# EAGLE design led_driver_12v_1a (EAGLE 7.5.0)
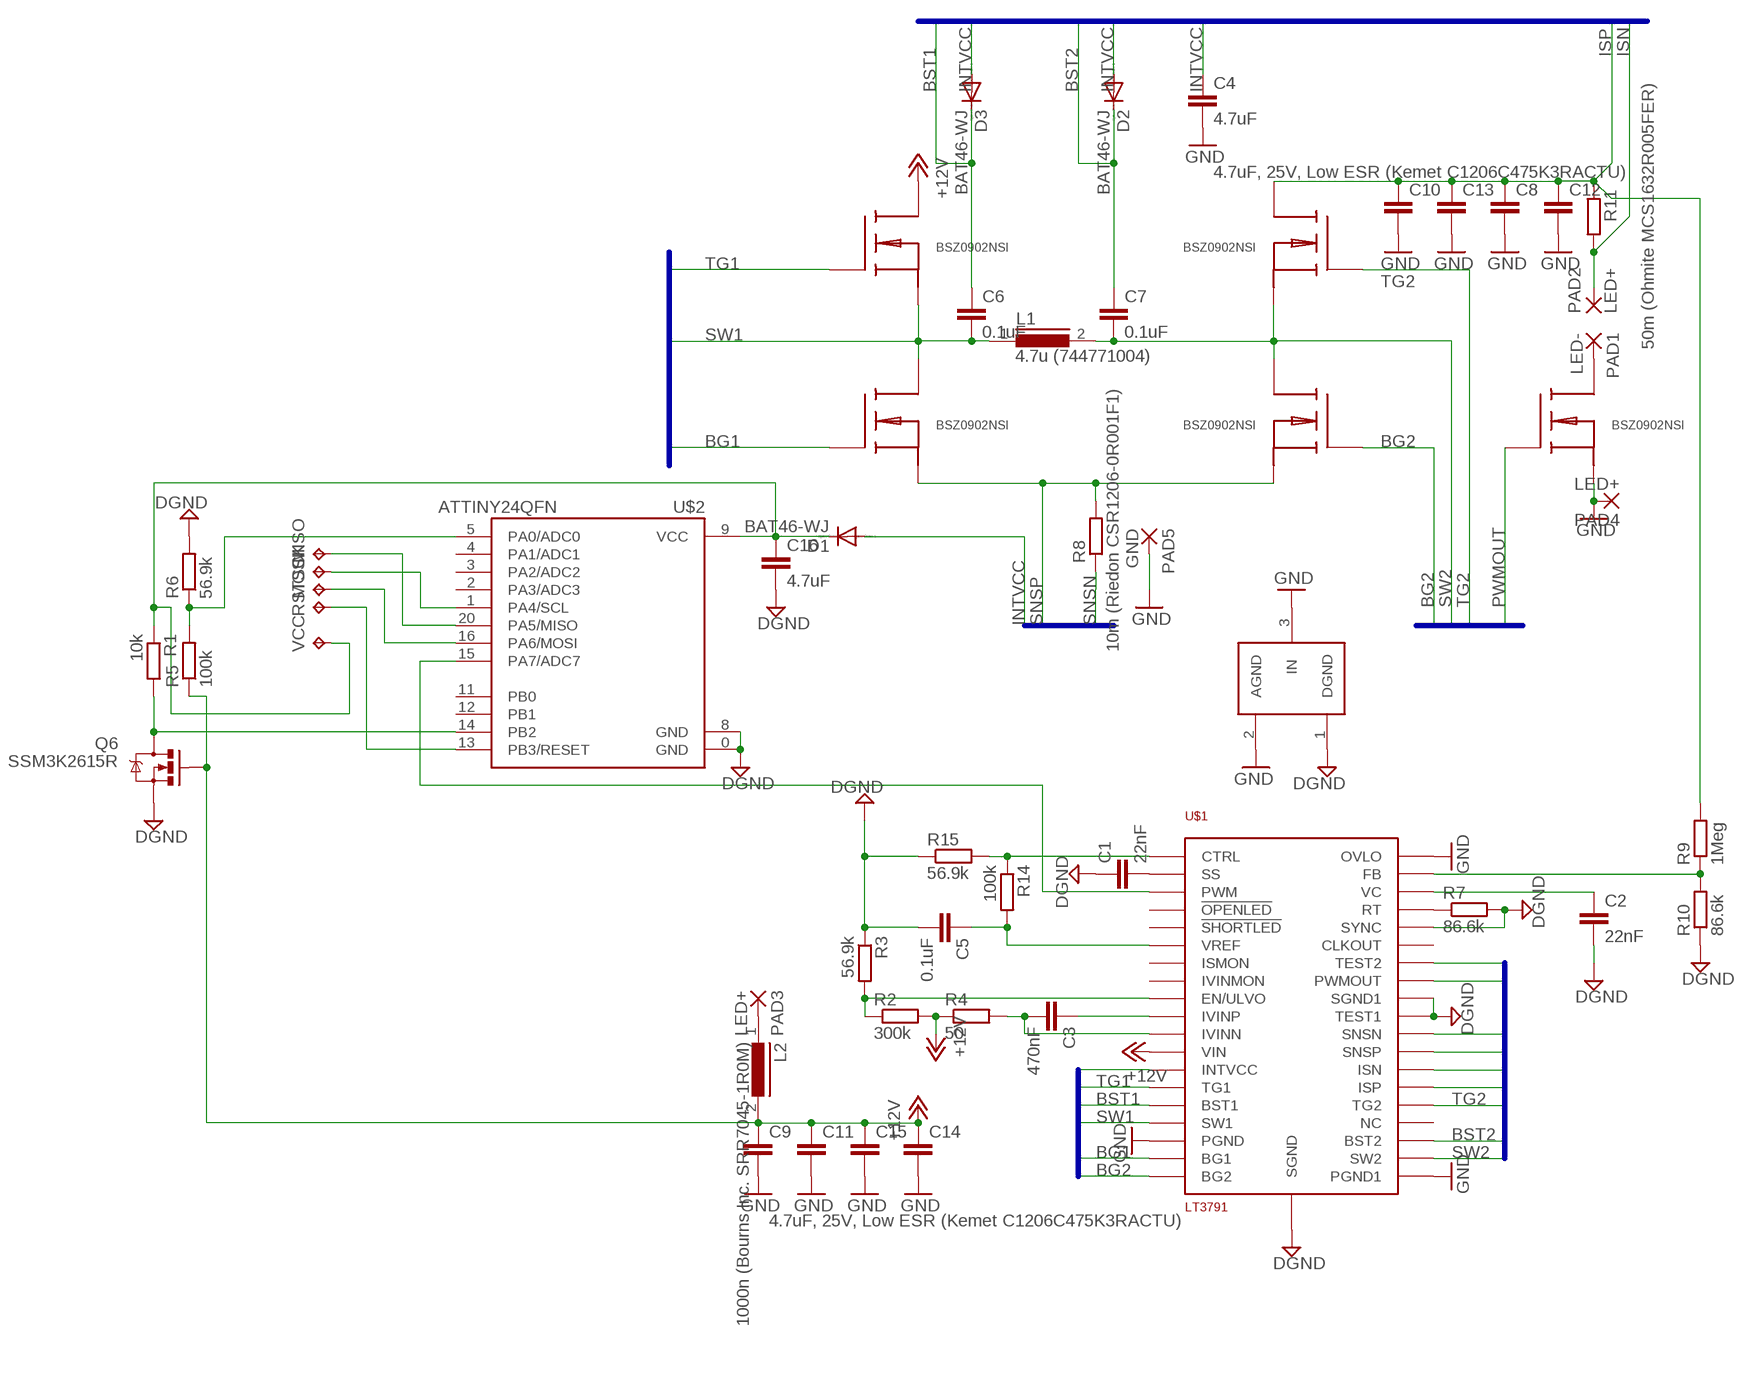
[diagram p0: schematic, sheet 1]

## Parts
C1  22nF  C-EUC0402K  [C0402K]
C2  22nF  C-EUC0402K  [C0402K]
C3  470nF  C-EUC0402K  [C0402K]
C4  4.7uF  C-EUC1206  [C1206]
C5  0.1uF  C-EUC0402K  [C0402K]
C6  0.1uF  C-EUC0402K  [C0402K]
C7  0.1uF  C-EUC0402K  [C0402K]
C8  4.7uF, 25V, Low ESR (Kemet C1206C475K3RACTU)  C-EUC1206  [C1206]
C9  4.7uF, 25V, Low ESR (Kemet C1206C475K3RACTU)  C-EUC1206  [C1206]
C10  4.7uF, 25V, Low ESR (Kemet C1206C475K3RACTU)  C-EUC1206  [C1206]
C11  4.7uF, 25V, Low ESR (Kemet C1206C475K3RACTU)  C-EUC1206  [C1206]
C12  4.7uF, 25V, Low ESR (Kemet C1206C475K3RACTU)  C-EUC1206  [C1206]
C13  4.7uF, 25V, Low ESR (Kemet C1206C475K3RACTU)  C-EUC1206  [C1206]
C14  4.7uF, 25V, Low ESR (Kemet C1206C475K3RACTU)  C-EUC1206  [C1206]
C15  4.7uF, 25V, Low ESR (Kemet C1206C475K3RACTU)  C-EUC1206  [C1206]
C16  4.7uF  C-EUC1206  [C1206]
D1  BAT46-WJ  DIODE-SOD323-W  [SOD323-W]
D2  BAT46-WJ  DIODE-SOD323-W  [SOD323-W]
D3  BAT46-WJ  DIODE-SOD323-W  [SOD323-W]
L1  4.7u (744771004)  DR127  [DR127]
L2  1000n (Bourns Inc. SRR7045-1R0M)  DR74  [DR74]
MISO  TPTP11R  [TP11R]
MOSI  TPTP11R  [TP11R]
PAD1  LED-  WIREPADSMD5-2,5  [5-2,5]
PAD2  LED+  WIREPADSMD5-2,5  [5-2,5]
PAD3  LED+  WIREPADSMD5-2,5  [5-2,5]
PAD4  LED+  WIREPADSMD5-2,5  [5-2,5]
PAD5  GND  WIREPADSMD1,27-254  [SMD1,27-2,54]
Q1  BSZ0902NSI  BSZ090X  [BSZ090X]
Q2  BSZ0902NSI  BSZ090X  [BSZ090X]
Q3  BSZ0902NSI  BSZ090X  [BSZ090X]
Q4  BSZ0902NSI  BSZ090X  [BSZ090X]
Q5  BSZ0902NSI  BSZ090X  [BSZ090X]
Q6  SSM3K2615R  MOSFET-NCHANNELBSS123LT1G  [SOT23-3]
R1  10k  R-EU_R0402  [R0402]
R2  300k  R-EU_R0402  [R0402]
R3  56.9k  R-EU_R0402  [R0402]
R4  50  R-EU_R0402  [R0402]
R5  100k  R-EU_R0402  [R0402]
R6  56.9k  R-EU_R0402  [R0402]
R7  86.6k  R-EU_R0402  [R0402]
R8  10m (Riedon CSR1206-0R001F1)  R-EU_R1206  [R1206]
R9  1Meg  R-EU_R0402  [R0402]
R10  86.6k  R-EU_R0402  [R0402]
R11  50m (Ohmite MCS1632R005FER)  R-EU_R1206  [R1206]
R14  100k  R-EU_R0402  [R0402]
R15  56.9k  R-EU_R0402  [R0402]
RST  TPTP11R  [TP11R]
SCK  TPTP11R  [TP11R]
U$1  LT3791  [TSSOP38]
U$2  ATTINY24QFN  [QFN20]
U$4  GND_CONNECT  [GND_CONNECT]
VCC  TPTP11R  [TP11R]

## Nets
+12V: C9.1 C11.1 C14.1 C15.1 L2.2 Q1.D Q1.D@1(D) Q1.D@2(D) Q1.D@3(D) Q1.D@4(D) Q6.1(G) R2.2 R4.1 R5.1 U$1.P$12(VIN)
BG1 [HI_PWR]: Q2.G U$1.P$18(BG1)
BG2 [HI_PWR]: Q3.G U$1.P$19(BG2)
BST1 [HI_PWR]: C6.1 D3.C U$1.P$15(BST1)
BST2 [HI_PWR]: C7.1 D2.C U$1.P$22(BST2)
DGND: C1.1 C2.2 C5.2 C16.2 Q6.2(S) R3.1 R6.2 R7.2 R10.1 R15.1 U$1.P$29(TEST1) U$1.P$30(SGND) U$1.P$34(SYNC) U$1.P$39(SGND1) U$2.0(GND) U$2.8(GND) U$4.1(DGND)
GND [HI_PWR]: C4.2 C8.2 C9.2 C10.2 C11.2 C12.2 C13.2 C14.2 C15.2 PAD4.1(P) PAD5.1(P) Q5.S@1(S) Q5.S@2(S) Q5.S@3(S) Q5.S@4(S) U$1.P$17(PGND) U$1.P$20(PGND1) U$1.P$38(OVLO) U$4.2(AGND) U$4.3(IN)
INTVCC [HI_PWR]: C4.1 D1.A D2.A D3.A U$1.P$13(INTVCC) U$1.P$32(TEST2)
ISN: PAD2.1(P) R11.2 U$1.P$26(ISN)
ISP: C8.1 C10.1 C12.1 C13.1 Q4.D Q4.D@1(D) Q4.D@2(D) Q4.D@3(D) Q4.D@4(D) R9.2 R11.1 U$1.P$25(ISP)
N$1: C5.1 R14.2 U$1.P$6(VREF)
N$2: R14.1 R15.2 U$1.P$1(CTRL)
N$3: R7.1 U$1.P$35(RT)
N$4: C1.2 U$1.P$2(SS)
N$5: C2.1 U$1.P$36(VC)
N$6: R9.1 R10.2 U$1.P$37(FB)
N$7: C3.1 U$1.P$10(IVINP)
N$9: C3.2 R4.2 U$1.P$11(IVINN)
N$11: R2.1 R3.2 U$1.P$9(EN/ULVO)
N$12: C16.1 D1.C R1.1 U$2.9(VCC) VCC.TP
N$13: Q6.3(D) R1.2 U$2.14(PB2)
N$14: U$1.P$3(PWM) U$2.15(PA7/ADC7)
N$15: R5.2 R6.1 U$2.5(PA0/ADC0)
N$16: MISO.TP U$2.20(PA5/MISO)
N$17: MOSI.TP U$2.16(PA6/MOSI)
N$18: RST.TP U$2.13(PB3/RESET)
N$19: PAD1.1(P) Q5.D Q5.D@1(D) Q5.D@2(D) Q5.D@3(D) Q5.D@4(D)
N$20: SCK.TP U$2.1(PA4/SCL)
N$21: L2.1 PAD3.1(P)
PWMOUT [HI_PWR]: Q5.G U$1.P$31(PWMOUT)
SNSN [HI_PWR]: R8.1 U$1.P$28(SNSN)
SNSP [HI_PWR]: Q2.S@1(S) Q2.S@2(S) Q2.S@3(S) Q2.S@4(S) Q3.S@1(S) Q3.S@2(S) Q3.S@3(S) Q3.S@4(S) R8.2 U$1.P$27(SNSP)
SW1 [HI_PWR]: C6.2 L1.1 Q1.S@1(S) Q1.S@2(S) Q1.S@3(S) Q1.S@4(S) Q2.D Q2.D@1(D) Q2.D@2(D) Q2.D@3(D) Q2.D@4(D) U$1.P$16(SW1)
SW2 [HI_PWR]: C7.2 L1.2 Q3.D Q3.D@1(D) Q3.D@2(D) Q3.D@3(D) Q3.D@4(D) Q4.S@1(S) Q4.S@2(S) Q4.S@3(S) Q4.S@4(S) U$1.P$21(SW2)
TG1 [HI_PWR]: Q1.G U$1.P$14(TG1)
TG2 [HI_PWR]: Q4.G U$1.P$24(TG2)
Unconnected: U$1.P$4(!OPENLED) U$1.P$5(!SHORTLED) U$1.P$7(ISMON) U$1.P$8(IVINMON) U$1.P$23(NC) U$1.P$33(CLKOUT) U$2.2(PA3/ADC3) U$2.3(PA2/ADC2) U$2.4(PA1/ADC1) U$2.11(PB0) U$2.12(PB1)

## Buses
BG1,BG2,SW1,SW2,TG1,TG2,BST1,BST2,INTVCC
BG1,BG2,SW1,SW2,TG1,TG2,BST1,BST2,INTVCC,PWMOUT,SNSP,SNSN,ISN,ISP

## Library data of the parts
C1-C3 C5-C7 = resistor:C-EU: CAPACITOR, European symbol
C4 C8-C16 = rcl:C-EU: CAPACITOR, European symbol
D1-D3 = diode:DIODE-: DIODE
L1 = inductors:DR127: High Power Density, High Efficiency, Shielded Inductors Source: coiltronics_dr_series.pdf
L2 = inductors:DR74: High Power Density, High Efficiency, Shielded Inductors Source: coiltronics_dr_series.pdf
MISO MOSI RST SCK VCC = testpad:TP: Test pad
PAD1-PAD5 = wirepad:WIREPAD: Wire PAD connect wire on PCB
Q1-Q5 = vsd_custom:BSZ090X
Q6 = SparkFun-DiscreteSemi:MOSFET-NCHANNEL: Common NMOSFET Parts MFG P/N Store ID Prod ID FDD8780 TRANS-09984 SI7820DN TRANS-11055 FDS6630A IC-08089 2N7002PW TRANS-11151 FQP30N06L COM-10213 TRANS-10060 BSS123LT1G TRANS-08345 BSS138 TRANS-00830 BS170 2N7000; PROD_ID: TRANS-08345
R1-R11 R14 R15 = resistor:R-EU_: RESISTOR, European symbol
U$1 = ltc3791:LT3791
U$2 = SparkFun-DigitalIC:ATTINY24: Atmel 20-pin 2kB flash uC
U$4 = SparkFun-Passives:GND_CONNECT: Use to make a connection of multiple grounds in only one place.

## Net classes
0 default: width 0.152 mm, clearance 0.152 mm
1 HI_PWR: width 0.3 mm, drill 0.4 mm, clearance 0.15 mm

## Board
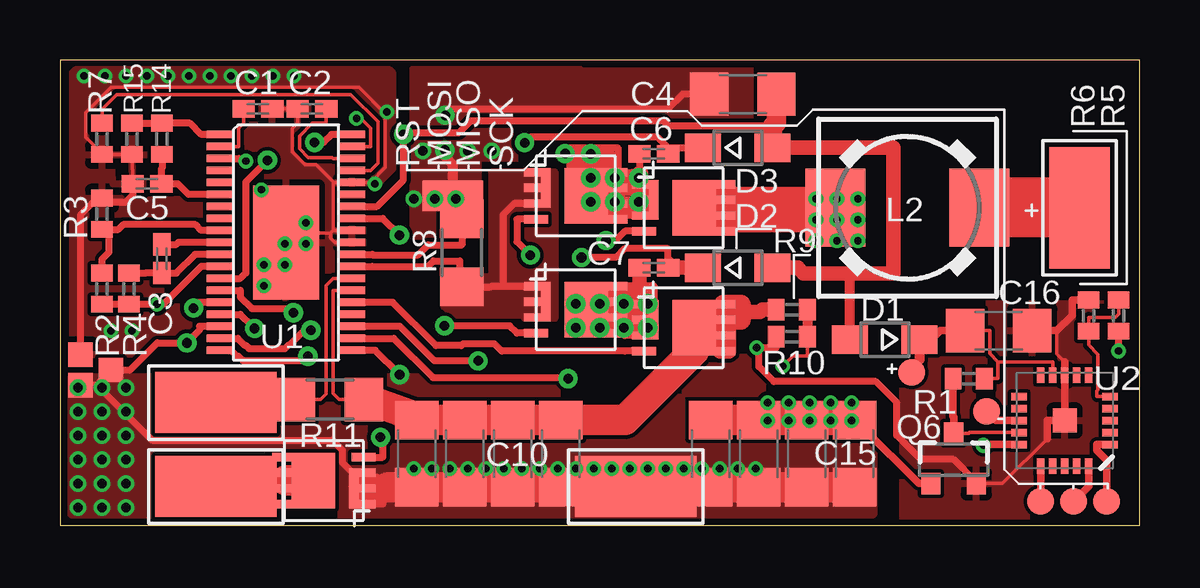
[diagram p1: board, top side]
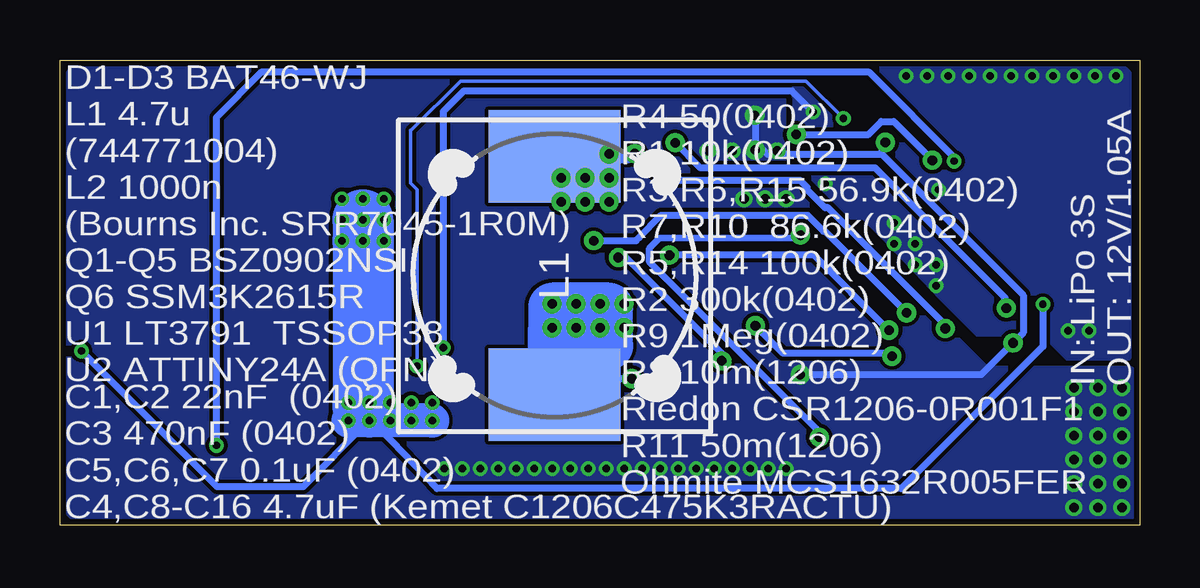
[diagram p2: board, bottom side, seen from below]

Size 45.02 x 19.41 mm. Coordinates in mm from the lower left corner, seen from the top.
Outline: 0,0 45.02,0 45.02,19.41 0,19.41 0,0
Copper layers (1*16): Top 0.035mm / dielectric 1.5mm / Bottom 0.035mm
Design rules "SeeedStudio_2layer_DRU_no_angle_20140221": minimum track width 6mil, minimum drill 12mil, track to track 6mil, track to pad 6mil, pad to pad 6mil, via to via 6mil, smd to smd 0mil, copper to edge 10mil, drill to drill 10mil, minimum pad ring 10mil, minimum via ring 6mil, stop-mask expansion 2mil, vias tented up to drill 100mil, thermal gap 10mil

### Footprints (pad centres in the part's own frame; a part is rotated, then mirrored left to right if it is on the bottom)
C0402K = smd 0.925 x 0.74: 1 -0.6,0; 2 0.6,0
C1206 = smd 1.6 x 1.8: 1 -1.4,0; 2 1.4,0
SOD323-W = smd 1.5 x 1.2: A 1.45,0; C -1.45,0
DR127 = smd 3.85 x 5.5: 1 -4.975,0; 2 4.975,0
DR74 = smd 2.5 x 3.25: 1 -3,0; 2 3,0
TP11R = smd 1.1 x 1.1: TP 0,0
5-2,5 = smd 2.54 x 5.08: 1 0,0
SMD1,27-2,54 = smd 1.27 x 2.54: 1 0,0
BSZ090X = smd 1.8 x 2.3: D 0.44,0 | smd 1 x 0.35: D@1 1.65,-0.975; D@2 1.65,-0.325; D@3 1.65,0.325; D@4 1.65,0.975; G -1.65,-0.975; S@2 -1.65,-0.325; S@3 -1.65,0.325; S@4 -1.65,0.975 | smd 0.4 x 1.65: S@1 -1.25,0.325
SOT23-3 = smd 0.8 x 0.9: 1 -0.95,-1; 2 0.95,-1; 3 0,1.1
R0402 = smd 0.7 x 0.9: 1 -0.65,0; 2 0.65,0
R1206 = smd 1.6 x 1.803: 1 -1.422,0; 2 1.422,0
TSSOP38 = smd 1.1 x 0.315: P$1 -2.75,4.5; P$2 -2.75,4; P$3 -2.75,3.5; P$4 -2.75,3; P$5 -2.75,2.5; P$6 -2.75,2; P$7 -2.75,1.5; P$8 -2.75,1; P$9 -2.75,0.5; P$10 -2.75,0; P$11 -2.75,-0.5; P$12 -2.75,-1; P$13 -2.75,-1.5; P$14 -2.75,-2; P$15 -2.75,-2.5; P$16 -2.75,-3; P$17 -2.75,-3.5; P$18 -2.75,-4; P$19 -2.75,-4.5; P$20 2.75,-4.5; P$21 2.75,-4; P$22 2.75,-3.5; P$23 2.75,-3; P$24 2.75,-2.5; P$25 2.75,-2; P$26 2.75,-1.5; P$27 2.75,-1; P$28 2.75,-0.5; P$29 2.75,0; P$30 2.75,0.5; P$31 2.75,1; P$32 2.75,1.5; P$33 2.75,2; P$34 2.75,2.5; P$35 2.75,3; P$36 2.75,3.5; P$37 2.75,4; P$38 2.75,4.5 | smd 2.75 x 4.75: P$39 0,0
QFN20 = smd 1 x 1: 0 0,0 | smd 0.65 x 0.3: 1 -1.9,1; 2 -1.9,0.5; 3 -1.9,0; 4 -1.9,-0.5; 5 -1.9,-1; 11 1.9,-1; 12 1.9,-0.5; 13 1.9,0; 14 1.9,0.5; 15 1.9,1 | smd 0.3 x 0.65: 6 -1,-1.9; 7 -0.5,-1.9; 8 0,-1.9; 9 0.5,-1.9; 10 1,-1.9; 16 1,1.9; 17 0.5,1.9; 18 0,1.9; 19 -0.5,1.9; 20 -1,1.9
GND_CONNECT = smd 1.016 x 1.016: 1 -1.016,0; 2 -1.016,-1.27; 3 0.254,-0.635

### Placement (x,y rotation side)
C1  8.25,17.38 180 top
C2  10.5,17.38 180 top
C3  4.25,11.12 270 top
C4  28.46,17.99 180 top
C5  3.62,14.25 180 top
C6  24.75,15.5 180 top
C7  24.75,10.75 180 top
C8  16.88,3 270 top
C9  27.12,3 270 top
C10  20.88,3 270 top
C11  29.12,3 270 top
C12  14.88,3 270 top
C13  18.88,3 270 top
C14  33.12,3 270 top
C15  31.12,3 270 top
C16  39.12,8.12 0 top
D1  34.38,7.75 180 top
D2  28.25,10.75 0 top
D3  28.25,15.75 0 top
L1  24.4,10.43 270 bottom
L2  35.33,13.25 180 top
MISO  42.25,1 90 top
MOSI  40.88,1 90 top
PAD1  6.5,1.62 270 top
PAD2  6.5,5.12 270 top
PAD3  42.5,13.25 0 top
PAD4  24,1.62 90 top
PAD5  16.38,13.75 270 top
Q1  26,13.25 0 top
Q2  21.5,13.75 0 top
Q3  21.5,9 0 top
Q4  26,8.25 0 top
Q5  11,1.88 180 top
Q6  37.25,2.75 0 top
R1  37.88,6.12 180 top
R2  1.75,9.88 270 top
R3  1.75,13 270 top
R4  2.88,9.88 90 top
R5  44.12,8.75 90 top
R6  42.88,8.75 90 top
R7  1.75,16.12 270 top
R8  16.75,11.38 270 top
R9  30.5,9 180 top
R10  30.5,7.88 0 top
R11  11.25,5.25 180 top
R14  4.25,16.12 270 top
R15  3,16.12 90 top
RST  38.62,4.75 90 top
SCK  43.62,1 90 top
U$1  9.42,11.8 0 top
U$2  41.88,4.38 180 top
U$4  1.88,7.12 0 top
VCC  35.5,6.38 90 top

### Tracks (layer width: path | path; a pad name or v marks a point on that pad's centre or on a via)
+12V  (via drill 0.3 pad 0.61)
  Top 0.152: L2.2 32.24,13.25 32.22,13.25 32.02,13.18 | 27.76,12.24 28.01,12.65 | 31.2,4.79 v33,4.38 31.84,4.77 31,4.68 31.12,4.91 | C14.1 33.25,4 33.42,4.12 | 31.12,4.66 31.74,4.66 32,4.4 | 31.12,4.66 31.12,4.91 | C15.1 31.12,4.66 | 31.12,4.91 30.77,4.91 30.25,4.4 | 28.01,12.65 26.51,13.18 Q1.D@2 27.57,13.01 27.94,13.25 | Q1.D@1 28.01,12.65 | Q1.D@4 28,14.22 28,13.57 Q1.D@3 27.94,13.49 27.94,13.25 | R4.1 3.21,9.22 | Q1.D 27.94,13.25
  Top 0.3: 3.21,9.22 v4.04,9.22 4.31,9.22 5.89,10.8 U$1.P$12 | v44.12,7.28 R5.1 | R4.1 R2.2 | 32.49,12.73 33.26,12.73 v33.26,12.75 | v33.26,11.88 v33.26,12.75 | v33.26,13.63 v33.26,12.75 | v32.39,13.63 32.33,13.63 L2.2 | 31.51,13.18 v31.51,12.75 | 32.02,13.18 31.51,13.18 | 31.51,13.18 v31.51,13.63 | v31.25,5.12 31.12,5.12 31.12,4.91 | C15.1 31.25,4.4 v31.25,4.38 | 30.25,4.4 30.38,4.4 v30.38,4.38 | C11.1 29.5,4.4 v30.38,5.12 | v29.5,5.12 v29.5,4.38
  Top 0.305: Q6.1 35.8,1.75 33.42,4.12
  Top 1.27: C14.1 32,4.4 | 30.25,4.4 C11.1 C9.1
  Top 1.676: 32.24,13.25 32.49,12.73 v32.39,12.75
  Top 1.9: 26.51,13.18 32.02,13.18
  Bottom 0.3: v4.04,9.22 4.04,7.46 9.95,1.55 29.3,1.55 32.12,4.5 | 32.12,4.5 v33,4.38 32.25,4.25 34.88,1.62 38.47,1.62 v44.12,7.28 | v31.51,12.75 v31.51,11.88 | v32.12,5.12 32.12,4.97 32.39,4.97 33,4.97 v33,5.12 | 32.12,4.5 v32.12,4.38
  Bottom 1.422: 32.39,4.97 v33,4.38 v32.12,4.38 v29.5,4.38
  Bottom 2.54: v32.39,12.75 v32.39,11.88 32.39,4.97
BG1  (via drill 0.4 pad 0.8)
  Top 0.3: v19.61,11.28 19.05,11.84 19.05,12.78 Q2.G | U$1.P$18 7.41,7.8 7.69,7.52 7.73,7.52 7.88,7.38 9.38,7.38 9.52,7.52 9.54,7.52 10.17,8.14 v10.46,8.14
  Bottom 0.3: v10.46,8.14 13.59,11.28 v19.61,11.28
BG2  (via drill 0.4 pad 0.8)
  Top 0.3: v16.02,8.33 18.75,8.33 19.05,8.03 Q3.G | v10.33,7.06 10.25,7 10.12,6.88 7.62,6.88 7.44,7.06 7.39,7.06 7.14,7.3 U$1.P$19
  Bottom 0.3: v10.33,7.06 10.38,7.12 10.43,7.18 14.88,7.18 v16.02,8.33
BST1  (via drill 0.4 pad 0.8)
  Top 0.3: U$1.P$15 5.81,9.3 v5.57,9.07 | v19.37,15.96 19.62,16.21 24.89,16.21 25.35,15.75 | 25.35,15.75 D3.C | 25.35,15.75 25.35,15.62 C6.1
  Bottom 0.3: v5.57,9.07 5.5,9.12 5.62,9.25 5.62,9.5 11.04,14.91 11.41,14.91 18.31,14.91 v19.37,15.96
BST2  (via drill 0.4 pad 0.8)
  Top 0.3: v17.43,6.87 15.61,6.87 14.17,8.3 U$1.P$22 | 25.35,11.09 25.41,11.09 25.75,10.75 | 25.35,11.09 25.35,11.54 23.54,11.54 23.17,11.18 v21.74,11.18 | C7.1 25.35,11.09
  Top 0.61: D2.C 25.75,10.75
  Bottom 0.3: v17.43,6.87 17.38,7.12 21.43,11.18 v21.74,11.18
DGND  (via drill 0.3, 0.3 pad 0.61)
  Top 0.152: 11.43,14.3 10.69,15.04 10.22,15.04 9.68,15.59 9.68,16.55 9.9,16.78 9.9,17.08 | 11.43,14.3 11.39,14.27 11.39,12.3 | C1.1 9.54,17.38 9.84,17.08 9.9,17.08 | C2.2 9.9,17.08 | 13.56,17.18 13.56,14.92 12.95,14.3 U$1.P$34 11.43,14.3 | v13.62,17.25 13.56,17.18 | 13.56,17.18 12.46,18.28 2.13,18.28 1.07,17.22 1.07,16.2 1.8,15.47 | R10.1 29.85,7.41 | 1.8,15.47 1.95,15.47 2.01,15.47 2.43,15.47 R15.1 3,14.87 3.02,14.85 C5.2 | R7.2 1.8,15.47 | 41.88,6.83 41.55,7.15 41.55,8.12 | U$2.0 41.74,4.38 | 11.39,12.3 11.28,12.19 | U$1.P$30 11.39,12.3 | 11.28,12.19 11.28,12 11.47,11.8 U$1.P$29 | 1.64,13.74 1.75,13.49 R3.1 | Q6.2 38.51,1.75 38.83,1.75 | 41.15,3.62 39.27,1.75 38.83,1.75 | 38.83,1.75 | 11.28,12.19 9.42,12.19 U$1.P$39
  Top 0.3: 29.85,7.41 v29.04,7.41 29.12,7.33 29.12,6.62 29.75,6 34,6 34.88,5.12 34.88,3.75 35.88,2.75 37.25,2.75 38.2,1.8 Q6.2 | U$4.1 0.86,12.96 1.64,13.74 | C5.2 3.02,13.78 2.73,13.49 1.75,13.49
  Top 0.305: R6.2 42.2,9.4 42.2,8.77 41.55,8.12 C16.2 | 41.88,6.83 U$2.8 U$2.0 | 41.74,4.38 41.15,4.38 41.15,3.62
  Bottom 0.3: v13.62,17.25 14.5,18.12 28.19,18.12 29.04,17.27 v29.04,7.41
  other vias: 2.12,8.12 3,8.12 8.5,10.88 9.38,10.88 9.38,11.75 10.25,11.75 10.25,12.62 8.5,10 13.12,14.25 1,18.75 1.88,18.75 2.75,18.75 3.62,18.75 4.5,18.75 5.38,18.75 6.25,18.75 7.12,18.75 8,18.75 8.88,18.75 9.75,18.75 8.39,14.01
  pour Top: 0.5,6.75 5.5,6.75 8,9.25 12.5,9.25 12.62,9.38 12.62,13.62 13.88,14.88 13.88,18.88 13.75,19 0.62,19 0.5,18.88
  pour Top: 35.12,9.25 44.5,9.25 44.5,0.25 35.12,0.25
  pour Bottom: 0.5,7 3,7 4,8 6.75,8 8.25,9.5 10.38,11.75 11.5,12.88 12,12.88 14.25,15.12 14.38,18.75 14.12,19 0.62,19 0.5,18.88
GND  (via drill 0.3, 0.4, 0.4 pad 0.8)
  Top 0.3: v10.61,15.98 10.99,15.98 11.32,16.3 U$1.P$38 | U$1.P$17 5.82,8.3 5.82,8.14 v5.29,7.61 4.06,7.61 2.94,6.49 U$4.3 1.67,6.03 1.67,5.86 | v16.05,17.11 16.12,17.25 16.23,17.36 25.33,17.36 25.96,17.99 C4.2 | Q5.S@3 Q5.S@1 12.25,2.2 | v14.15,6.29 13.14,7.3 U$1.P$20 | 1.67,5.86 1.67,5.72 3.83,3.55 11.36,3.55 11.76,3.15 11.76,2.64 12.2,2.2 12.25,2.2 | U$4.2 1.67,5.86 | C10.2 22.07,1.6 22.07,2.65 22.43,2.75 PAD4.1 25.45,2.5 26,2.7 26,2.2 27.12,2.15 | 13.36,1.29 13.45,1.2 13.45,0.9 Q5.S@4 | 13.05,1.55 13.1,1.55 13.36,1.29 | 13.68,1.6 13.36,1.29 | 27.12,2.15 27.38,2.15 27.93,1.6 | C9.2 27.12,2.15 | Q5.S@2 12.25,2.2
  Top 0.406: v16.04,15.66 16.04,15.4 16.38,15.06 PAD5.1
  Top 1.27: C10.2 C13.2 C8.2 C12.2 13.68,1.6 | Q5.S@3 13.05,1.55 | 27.93,1.6 C11.2 C15.2 C14.2
  Bottom 0.3: 10.8,15.54 4.87,9.6 4.87,8.04 v5.29,7.61 6.61,6.29 v14.15,6.29 | 15.99,15.96 15.52,15.48 10.75,15.48 10.8,15.54 | 10.8,15.54 v10.61,15.98 | 15.99,15.96 15.99,17.3 v16.05,17.11 | 15.99,15.96 v16.04,15.66
  other vias: 22.25,2.38 23,2.38 23.75,2.38 24.5,2.38 25.25,2.38 26,2.38 26.75,2.38 27.5,2.38 28.25,2.38 29,2.38 21.5,2.38 20.75,2.38 20,2.38 19.25,2.38 18.5,2.38 17.75,2.38 17,2.38 16.25,2.38 15.5,2.38 14.75,2.38 0.75,0.75 1.75,0.75 2.75,0.75 2.75,1.75 1.75,1.75 0.75,1.75 0.75,2.75 1.75,2.75 2.75,2.75 0.75,3.75 1.75,3.75 2.75,3.75 2.75,4.75 2.75,5.75 1.75,5.75 1.75,4.75 0.75,4.75 0.75,5.75 14.75,13.62 15.62,13.62 16.5,13.62 15.12,15.62 17,15.62 18,15.62
  pour Bottom: 0.5,6.5 6.38,6.5 14.88,15 14.88,18.88 15,19 44.5,19 44.62,18.88 44.62,0.5 44.5,0.38 0.38,0.38 0.38,6.5
  pour Top (no thermals): 0.5,6.12 0.5,0.5 33.88,0.5 33.88,10.75 44.5,10.75 44.5,18.88 21.38,18.88 21.38,7.88 15,7.88 15,6.12
  pour Top (no thermals): 14.75,19 14.75,12.12 17.38,12.12 17.38,15.38 21.62,15.38 21.62,19
INTVCC  (via drill 0.4 pad 0.8)
  Top 0.3: 34.74,10.6 34.74,10.5 | 33,10.5 32.91,10.52 | 29.7,16.47 29.51,16.67 25.33,16.67 25.12,16.88 17.12,16.88 16.62,16.38 14.38,16.38 14.3,16.29 v14.32,16.31 14.32,14.41 13.22,13.3 U$1.P$32 | v8.65,15.23 7.74,14.33 7.74,10.53 7.52,10.3 U$1.P$13 | 29.84,16.79 29.86,16.79
  Top 0.406: 32.91,10.52 32.91,8.66 32.92,8.65 D1.A
  Top 0.61: D3.A 34.35,15.75 34.74,15.75 34.74,10.6 | 34.74,10.5 33,10.5 | 32.91,10.52 30.98,10.52 30.75,10.75 D2.A
  Top 0.813: D3.A 29.7,16.47 29.7,16.65 29.84,16.79 | C4.1 29.86,16.79
  Bottom 0.3: v14.32,16.31 11.31,16.31 10.78,16.84 10.26,16.84 v8.65,15.23
ISN
  Top 0.152: U$1.P$26 11.39,10.3 11.09,10 11.09,5.48 10.86,5.25 R11.2 9.39,5.25 9.27,5.12 PAD2.1
ISP
  Top 0.152: C10.1 20.5,4.3 20.78,4.43 21,4.4 | U$1.P$25 11.39,9.8 11.39,5.5 11.64,5.25 R11.1 12.58,5.75 13,5.2 | 26.44,7.56 26.64,7.56 26.42,7.28 Q4.D@1 | 28.38,8.59 28.38,8.57 | C12.1 14.87,4.53 | Q4.D@2 27.57,8.01
  Top 0.61: 28.7,8.91 28.38,8.59 | 28.7,8.91 29.18,8.91 29.27,9 R9.2 | 28.7,8.91 28.38,9.22 | Q4.D@3 27.57,8.49 27.88,8.5 27.88,7.25 27.5,7.25 27.5,8.75 27.57,8.75 27.57,8.25
  Top 0.813: Q4.D@3 28.38,8.57 | Q4.D@4 28.38,9.22 | 27.57,8.01 27.57,8.25 Q4.D
  Top 1.27: 21,4.4 23.54,4.4 26.42,7.28 | C10.1 C13.1 C8.1 C12.1 | Q4.D 26.44,7.56 | 14.87,4.53 13,5.2
N$1
  Top 0.3: R14.2 4.25,14.9 4.22,14.87 C5.1 4.92,14.25 5.36,13.8 U$1.P$6
N$2
  Top 0.3: U$1.P$1 5.89,16.3 5.42,16.77 R14.1 R15.2
N$3
  Top 0.152: R7.1 1.75,17.35 2.37,17.97 12.12,17.97 13.26,16.84 13.26,15.11 12.95,14.8 U$1.P$35
N$4
  Top 0.152: C1.2 7.65,16.78 7.45,16.57 7.45,15.8 U$1.P$2
N$5
  Top 0.152: U$1.P$36 11.39,15.3 11.35,15.35 10.35,15.35 9.98,15.72 9.98,16.24 10.52,16.78 11.1,16.78 C2.1
N$6  (via drill 0.3 pad 0.61)
  Top 0.152: v12.36,16.98 12.53,16.98 12.95,16.56 12.95,15.8 U$1.P$37 | R10.2 31.15,7.07 30.55,7.07 v30.13,6.65
  Top 0.406: R9.1 R10.2
  Bottom 0.152: v12.36,16.98 13.92,18.54 28.32,18.54 30.38,16.48 30.4,16.48 30.4,14.27 30.13,14 v30.13,6.65
N$7
  Top 0.3: C3.1 4.85,11.72 4.93,11.8 U$1.P$10
N$9
  Top 0.3: U$1.P$11 5.63,11.3 4.85,10.53 C3.2 3.55,10.53 R4.2
N$11
  Top 0.152: R3.2 2.05,12.35
  Top 0.3: R2.1 1.75,11.1 2.05,11.4 2.05,12.35 2.43,12.35 2.63,12.55 5.65,12.55 5.89,12.3 U$1.P$9
N$12
  Top 0.152: R1.1 39.1,6.12 39.1,6.83 | 35.91,7.34 35.83,7.34 D1.C | VCC.TP 35.38,6.47 | C16.1 38.75,8.12 38.75,7.18 39.1,6.83 | 39.1,6.83 41.38,6.83 U$2.9
  Top 0.305: C16.1 36.7,8.12 35.91,7.34 | 35.38,6.47 35.83,6.92
  Top 0.406: 35.83,7.34 35.83,6.92
N$13
  Top 0.152: Q6.3 37.88,3.85 37.9,3.88 U$2.14 | 37.23,4.55 37.25,4.53
  Top 0.305: Q6.3 37.25,4.53 | R1.2 37.23,4.55
N$14  (via drill 0.3 pad 0.61)
  Top 0.152: 38.52,3.38 v38.49,3.34
  Top 0.3: U$1.P$3 7.45,15.3 7.56,15.2 v7.75,15.2
  Top 0.305: U$2.15 38.52,3.38
  Bottom 0.152: 7.62,15.23 v7.75,15.2
  Bottom 0.29: 36.6,18.91 11.31,18.91
  Bottom 0.3: v38.49,3.34 38.49,17.03 36.6,18.91 | 11.31,18.91 7.62,15.23
N$15
  Top 0.152: U$2.5 43.22,5.38 43.22,5.62 43.25,5.66 43.25,7.14 42.88,7.52 R6.1 42.88,8.68 43.98,8.68 44.12,8.82 R5.2
N$16
  Top 0.305: U$2.20 42.88,1.62 MISO.TP
N$17
  Top 0.305: U$2.16 MOSI.TP
N$18
  Top 0.152: 39,4.38 RST.TP
  Top 0.305: U$2.13 39,4.38
N$19
  Top 0.152: Q5.D@1 8.62,2.85 8.62,2.2 Q5.D@2 9.43,2.12 9.43,1.88 9.43,1.63 Q5.D@3 8.99,1.55 8.62,1.55 | 8.62,1.55 5.95,1.55 PAD1.1 | Q5.D@4 8.62,0.9 8.62,1.55
  Top 1.27: Q5.D 9.43,1.88
N$20
  Top 0.305: U$2.1 43.22,3.38 43.22,3.13 43.62,2.72 SCK.TP
N$21
  Top 2.5: PAD3.1 L2.1
PWMOUT  (via drill 0.4 pad 0.8)
  Top 0.3: Q5.G 13.45,2.85 13.45,3.59 v13.36,3.68 | U$1.P$31 13.45,12.8 v14.15,12.11
  Bottom 0.3: v13.36,3.68 13.36,3.91 20.44,10.99 20.44,11.57 20.02,11.98 14.5,12 14.26,12 v14.15,12.11
SNSN
  Top 0.3: 15.35,11.7 14.94,11.29 13.04,11.29 13.02,11.3 U$1.P$28 | 15.35,11.7 | 15.35,11.7 16.75,11.7 R8.1
SNSP
  Top 0.3: 18.47,9.97 17.97,9.97 17.95,9.95 R8.2 16.75,10.2 16.75,10.38 16.66,10.46 16.66,11.03 15.57,11.03 15.34,10.8 13.02,10.8 U$1.P$27 | 18.47,9.97 Q3.S@4 20.02,9.97 20.2,9.97 20.25,9.93 Q3.S@1 | 18.47,9.97 18.47,12.97 18.93,13.43 Q2.S@2 20.25,13.43 | Q3.S@1 20.3,9.32 20.27,8.98 20.27,8.68 Q3.S@2 | Q3.S@3 Q3.S@1 | Q2.S@1 20.3,14.07 20.27,14.42 20.27,14.72 Q2.S@4 | Q2.S@3 Q2.S@1 | 20.25,13.43 | 20.25,13.43 Q2.S@1
  pour Top (no thermals): 16,10.38 17.88,10.38 18,10.5 18,14.75 20.62,14.75 20.62,8.62 19.38,8.62 19.25,8.75 16.38,8.75 16,9.12
SW1  (via drill 0.4 pad 0.8)
  Top 0.3: U$1.P$16 7.52,8.8 7.98,8.34 v8.11,8.22 | v21.06,15.51 21.56,15.51 22.35,14.72 | 23.55,14.22 23.4,14.07 Q2.D@3 23.14,13.75 | 23.55,14.72 | 23.55,14.72 23.55,14.75 21.25,14.75 21.25,15.75 23.25,15.75 23.25,14.88 21.38,14.88 21.38,15.5 v22.12,15.5 | v22.12,15.5 23,15.5 23,15.12 21.62,15.12 | 23.55,14.22 22.88,15.38 21.62,15.38 22.12,15.38 v22.12,15.5 | 23.55,14.72 23.85,14.72 23.95,14.72 24.05,14.83 24.15,14.83 C6.2 | Q1.S@4 22.88,14.5 v23.12,14.5 | v23.12,14.5 v24.12,14.5 | v24.12,14.5 24.25,14.5 | 24.25,14.5 24.25,14.38 22.88,14.38 22.88,14.12 24.38,14.12 | 24.38,14.12 24.38,13.88 23.38,13.88 23.38,13.5 v24.12,13.5 | v24.12,13.5 24.38,13.5 24.38,13.25 22.75,13.25 22.75,13 24.5,13 24.5,14.12 24.38,14.12 | 24.38,14.12 24.38,14.75 24.07,14.75 23.55,14.22 | Q2.D@4 23.55,14.72 | Q2.D@1 23.43,13.05 | 23.43,13.05 23.55,12.93 Q1.S@2 | 23.4,13.43 23.4,13.07 23.43,13.05 | 23.4,13.43 23.55,13.57 Q1.S@3 | Q2.D@2 23.4,13.43 | Q2.D@4 22.35,14.72 | Q2.D@2 23.15,13.74 23.14,13.75 | 23.14,13.75 Q2.D 22.12,13.75 v22.12,13.5 | Q1.S@3 Q1.S@1 | 22.35,14.72 22.12,14.72 v22.12,14.5 | Q2.D@4 23.12,14.72 v23.12,14.5 | Q2.D@2 23.12,13.43 v23.12,13.5 | Q1.S@3 24.12,13.57 v24.12,13.5 | 24.25,14.5 v24.12,14.5
  Top 0.61: 21.62,15.12 21.62,15.38
  Bottom 0.3: v8.11,8.22 8.11,8.36 8.25,8.5 13,13.25 13.12,13.25 13.88,14 13.88,14.11 14.16,14.39 19.94,14.39 20.19,14.64 v21.06,15.51 20.98,15.43
  Bottom 0.61: 20.98,15.43 21.35,15.4 L1.1
SW2  (via drill 0.4 pad 0.8)
  Top 0.3: 24.75,7.92 | 24.75,7.92 Q4.S@1 Q4.S@3 24.5,8.5 v22.5,8.25 | 24.75,7.92 Q4.S@2 23.55,7.92 23.3,8.18 | Q3.D@1 23.3,8.18 | 23.3,8.18 23.15,8.32 Q3.D@2 23.14,9 | U$1.P$21 13.91,7.8 15.55,6.17 20.73,6.17 v21.18,6.12 | 23.23,9.32 23.14,9.24 23.14,9 | 23.23,9.32 23.31,9.32 | Q3.D@3 23.23,9.32 | Q3.D 23.14,9 | 23.31,9.32 23.15,9.48 22.88,9.75 | 22.88,9.75 23.12,10 24.75,10 24.75,9.75 | 24.75,9.75 22.88,9.75 | 22.88,9.75 22.88,9.5 24.75,9.5 24.75,9.75 | 24.75,9.75 24.75,9 22.88,9 22.88,8.75 24.75,8.75 24.75,8.5 22.75,8.5 22.75,8.25 24.75,8.25 24.75,8.12 22.75,8.12 Q3.D@4 23.95,9.97 24.05,10.08 24.15,10.08 | 23.31,9.32 23.46,9.32 23.46,9.31 23.55,9.22 | Q4.S@4 23.55,9.22 | v21.5,9.25 Q3.D | Q3.D v21.5,8.25 | 23.3,8.18 v23.5,8.25 | 23.55,9.22 23.5,9.22 v23.5,9.25
  Top 0.61: C7.2 24.15,10.08
  Bottom 0.3: v21.18,6.12 22.3,6.12 22.48,6.08 L1.2 24.5,5.55 | 24.5,8.38 v23.5,8.25 | v22.5,8.25 22.73,8.8 | v22.5,9.25 22.5,9.12 | 24.5,9.12 v24.5,9.25
  Bottom 2: 24.5,5.55 v24.5,8.25 22.88,8.25 22.12,7.5 22.12,9.12 22.5,9.12 24.5,9.12 24.5,8.38
TG1  (via drill 0.4 pad 0.8)
  Top 0.3: v9.72,8.88 9.56,9.04 8,9.04 7.52,9.53 7.52,9.8 U$1.P$14 | v22.76,11.88 23.16,11.88 23.55,12.28 Q1.G
  Bottom 0.3: v22.76,11.88 21,11.88 20.88,12 19.96,12.94 13.86,12.94 13.2,12.27 | 13.2,12.27 | 13.2,12.27 13.12,12.27 v9.72,8.88
TG2
  Top 0.3: U$1.P$24 13.87,9.3 15.67,7.5 16.73,7.5 16.8,7.58 18.11,7.58 18.41,7.28 23.55,7.28 Q4.G

### Text on the board
tNames: D1 | U1 | U2
bNames: IN: LiPo 3S / OUT: 12V/1.05A | D1-D3 BAT46-WJ / L1 4.7u / (744771004) / L2 1000n / (Bourns Inc. SRR7045-1R0M) / Q1-Q5 BSZ0902NSI / Q6 SSM3K2615R / U1 LT3791 TSSOP38 / U2 ATTINY24A (QFN) | R4 50(0402) / R1 10k(0402) / R3,R6,R15 56.9k(0402) / R7,R10 86.6k(0402) / R5,R14 100k(0402) / R2 300k(0402) / R9 1Meg(0402) / R8 10m(1206) / Riedon CSR1206-0R001F1 / R11 50m(1206) / Ohmite MCS1632R005FER | C1,C2 22nF (0402) / C3 470nF (0402) / C5,C6,C7 0.1uF (0402) / C4,C8-C16 4.7uF (Kemet C1206C475K3RACTU)